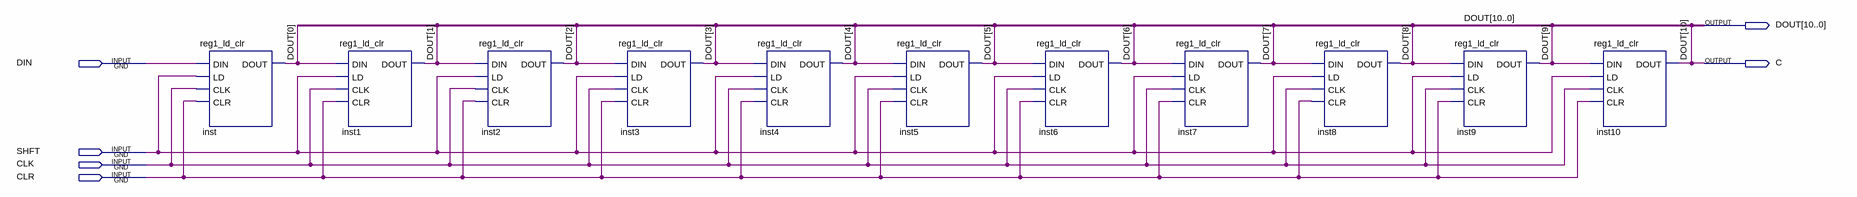
[diagram p0: schematic sheet]
// Quartus schematic reg11_sh_clr.bdf as structural Verilog: 11 symbols, 6 pins
module reg11_sh_clr (
  input  DIN,
  input  SHFT,
  input  CLK,
  input  CLR,
  output [10:0] DOUT,
  output C
);

  reg1_ld_clr inst (.DIN(DIN), .LD(SHFT), .CLK(CLK), .CLR(CLR), .DOUT(DOUT[0]));
  reg1_ld_clr inst1 (.DIN(DOUT[0]), .LD(SHFT), .CLK(CLK), .CLR(CLR), .DOUT(DOUT[1]));
  reg1_ld_clr inst2 (.DIN(DOUT[1]), .LD(SHFT), .CLK(CLK), .CLR(CLR), .DOUT(DOUT[2]));
  reg1_ld_clr inst3 (.DIN(DOUT[2]), .LD(SHFT), .CLK(CLK), .CLR(CLR), .DOUT(DOUT[3]));
  reg1_ld_clr inst4 (.DIN(DOUT[3]), .LD(SHFT), .CLK(CLK), .CLR(CLR), .DOUT(DOUT[4]));
  reg1_ld_clr inst5 (.DIN(DOUT[4]), .LD(SHFT), .CLK(CLK), .CLR(CLR), .DOUT(DOUT[5]));
  reg1_ld_clr inst6 (.DIN(DOUT[5]), .LD(SHFT), .CLK(CLK), .CLR(CLR), .DOUT(DOUT[6]));
  reg1_ld_clr inst7 (.DIN(DOUT[6]), .LD(SHFT), .CLK(CLK), .CLR(CLR), .DOUT(DOUT[7]));
  reg1_ld_clr inst8 (.DIN(DOUT[7]), .LD(SHFT), .CLK(CLK), .CLR(CLR), .DOUT(DOUT[8]));
  reg1_ld_clr inst9 (.DIN(DOUT[8]), .LD(SHFT), .CLK(CLK), .CLR(CLR), .DOUT(DOUT[9]));
  reg1_ld_clr inst10 (.DIN(DOUT[9]), .LD(SHFT), .CLK(CLK), .CLR(CLR), .DOUT(C));

  assign DOUT[10] = C;
endmodule
